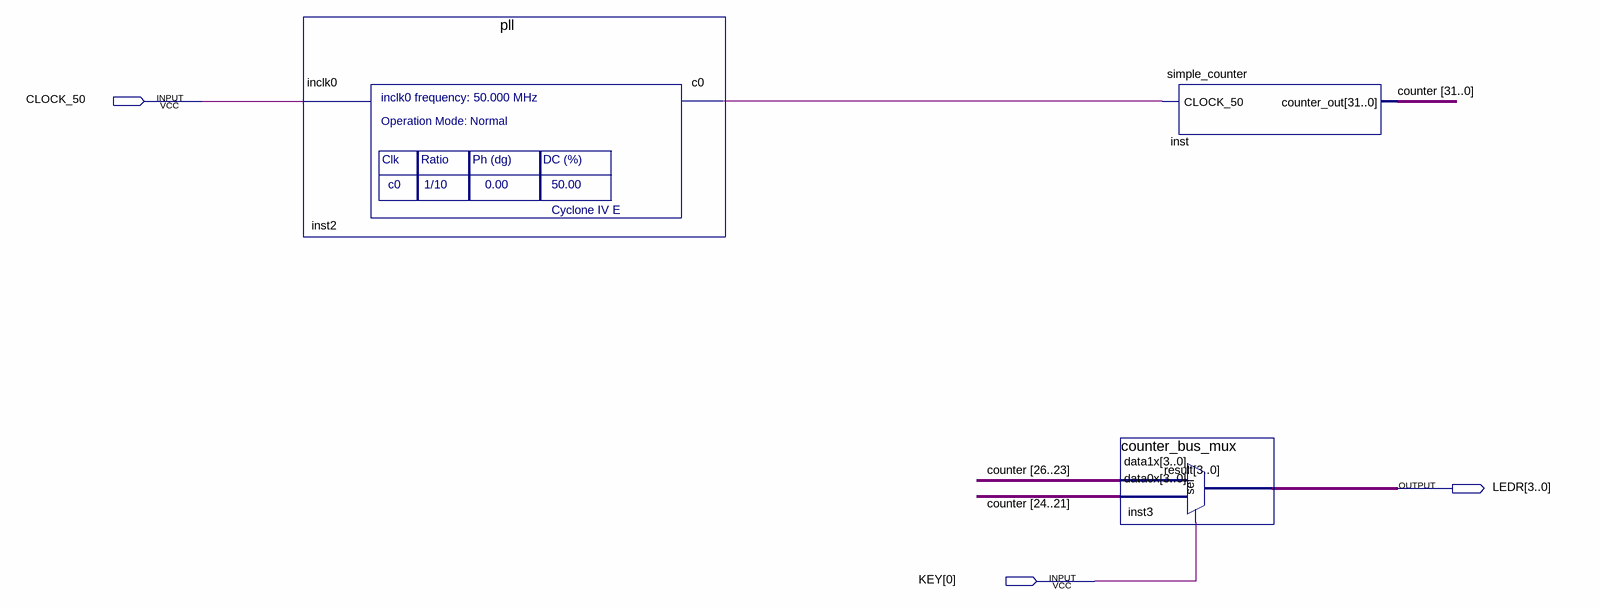
[diagram p0: schematic sheet]
// Quartus schematic my_first_fpga.bdf as structural Verilog: 3 symbols, 3 pins
module my_first_fpga (
  input  CLOCK_50,
  input  [0:0] KEY,
  output [3:0] LEDR
);

  wire inst2_c0;
  wire [31:0] counter;

  pll inst2 (.inclk0(CLOCK_50), .c0(inst2_c0));
  counter_bus_mux inst3 (.data1x(counter[26:23]), .data0x(counter[24:21]), .sel(KEY[0]), .result(LEDR));
  simple_counter inst (.CLOCK_50(inst2_c0), .counter_out(counter));
endmodule
